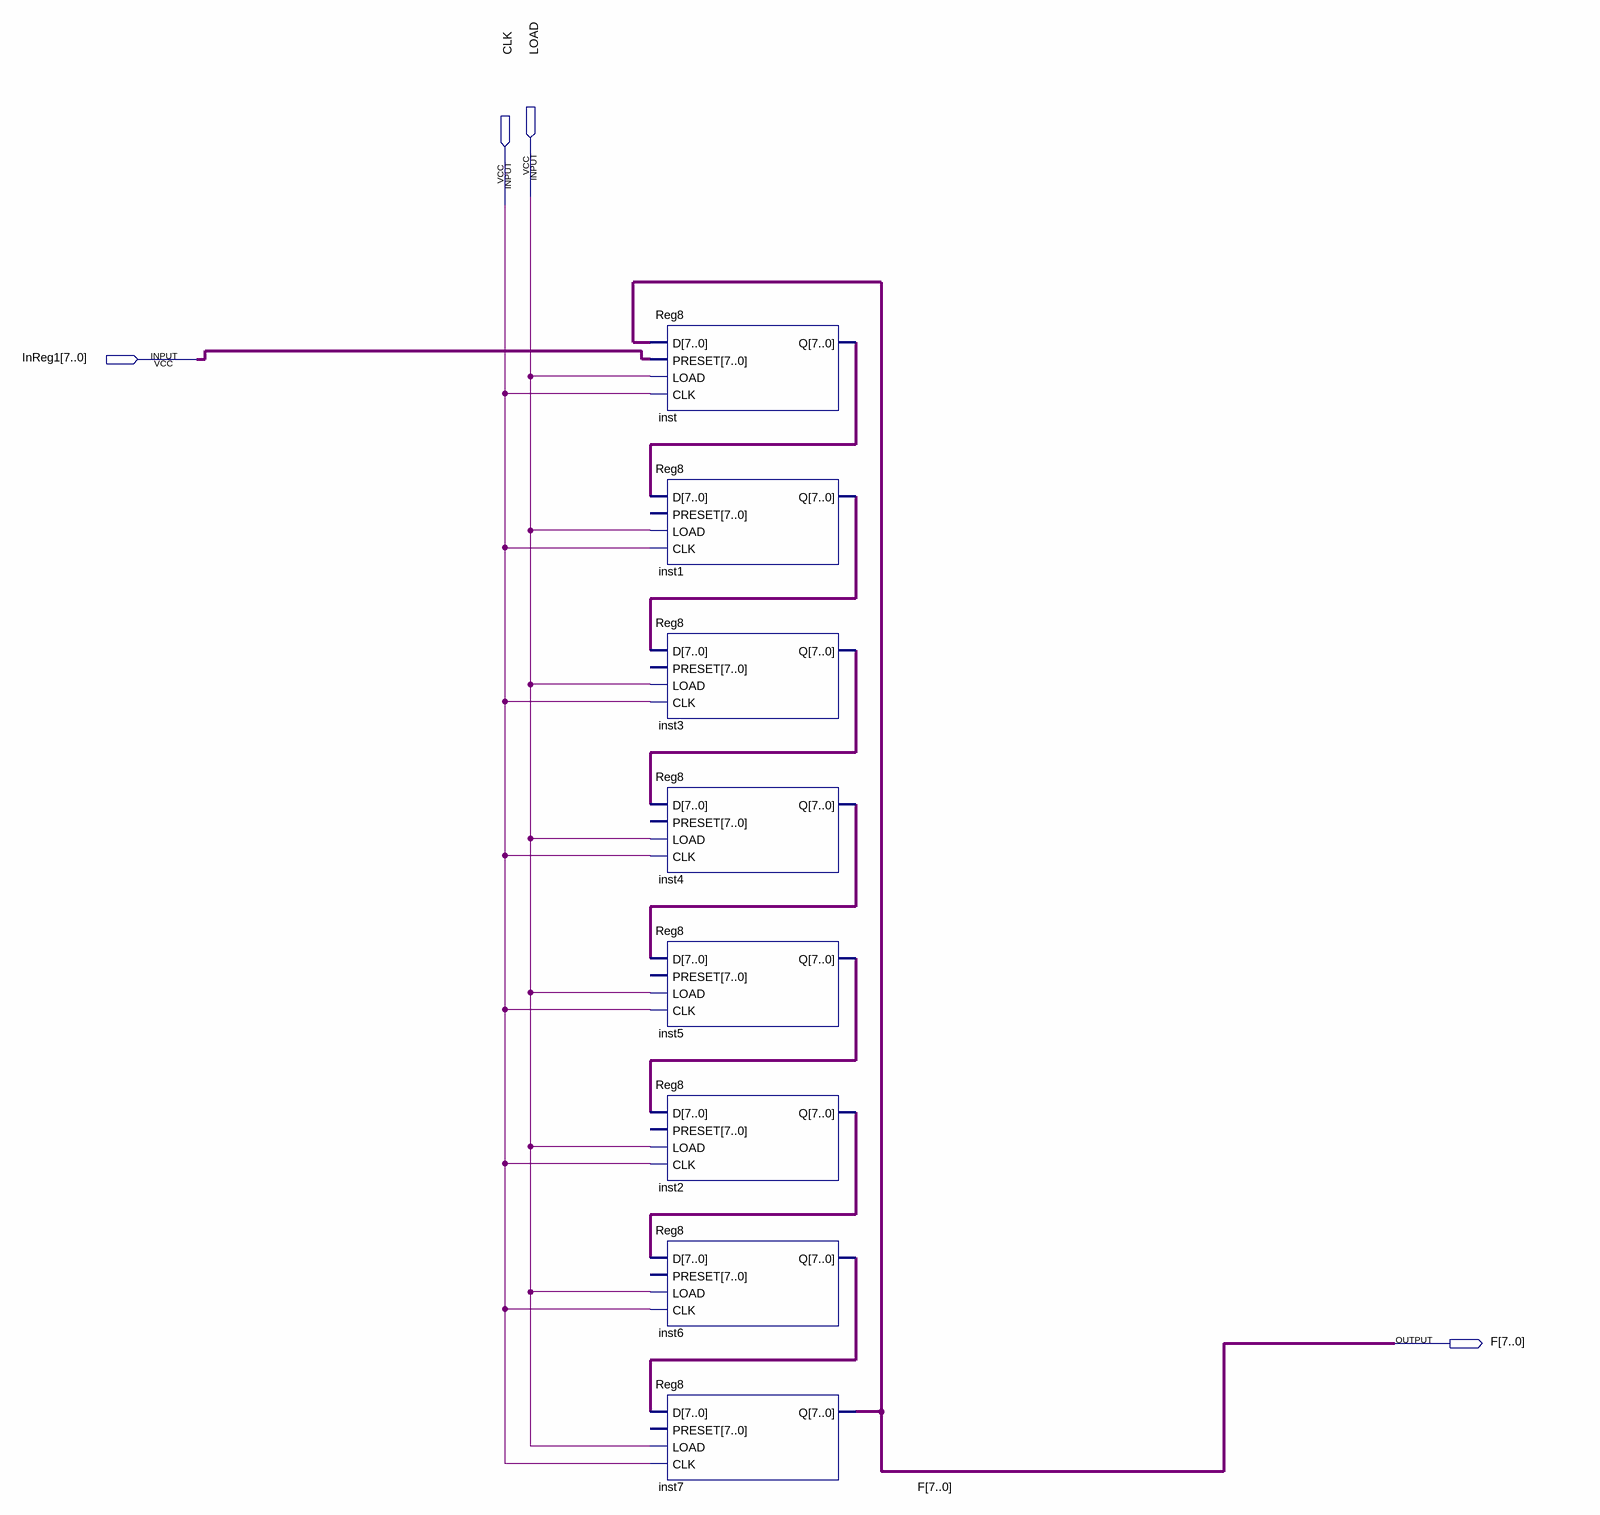
[diagram p0: schematic sheet]
// Quartus schematic PistaReg.bdf as structural Verilog: 8 symbols, 4 pins
module PistaReg (
  input  LOAD,
  input  CLK,
  input  [7:0] InReg1,
  output [7:0] F
);

  wire [7:0] inst1_q, inst2_q, inst3_q, inst4_q, inst5_q, inst6_q, inst_q;

  Reg8 inst (.D(F), .PRESET(InReg1), .LOAD(LOAD), .CLK(CLK), .Q(inst_q));
  Reg8 inst1 (.D(inst_q), .LOAD(LOAD), .CLK(CLK), .Q(inst1_q));  // open: PRESET
  Reg8 inst3 (.D(inst1_q), .LOAD(LOAD), .CLK(CLK), .Q(inst3_q));  // open: PRESET
  Reg8 inst4 (.D(inst3_q), .LOAD(LOAD), .CLK(CLK), .Q(inst4_q));  // open: PRESET
  Reg8 inst5 (.D(inst4_q), .LOAD(LOAD), .CLK(CLK), .Q(inst5_q));  // open: PRESET
  Reg8 inst2 (.D(inst5_q), .LOAD(LOAD), .CLK(CLK), .Q(inst2_q));  // open: PRESET
  Reg8 inst6 (.D(inst2_q), .LOAD(LOAD), .CLK(CLK), .Q(inst6_q));  // open: PRESET
  Reg8 inst7 (.D(inst6_q), .LOAD(LOAD), .CLK(CLK), .Q(F));  // open: PRESET
endmodule
